# EAGLE design 1-wire_board (EAGLE 6.2)
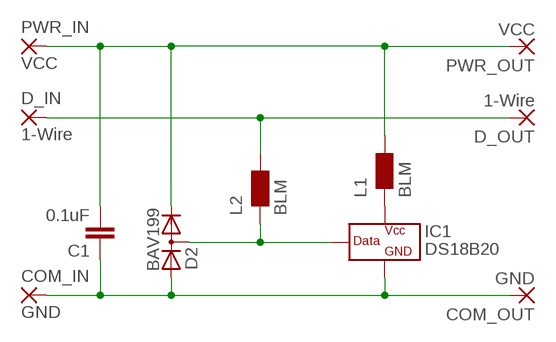
[diagram p0: schematic, sheet 1]

## Parts
C1  0.1uF  CAP0805  [0805]
COM_IN  GND  SMD5  [SMD2,54-5,08]
COM_OUT  GND  SMD5  [SMD2,54-5,08]
D2  BAV199  [SOT23]
D_IN  1-Wire  SMD5  [SMD2,54-5,08]
D_OUT  1-Wire  SMD5  [SMD2,54-5,08]
IC1  DS18B20  [TO92-]
L1  BLM  WE-KIHQWE-KI_0805  [0805]
L2  BLM  WE-KIHQWE-KI_0805  [0805]
PWR_IN  VCC  SMD5  [SMD2,54-5,08]
PWR_OUT  VCC  SMD5  [SMD2,54-5,08]

## Nets
N$1: D2.3(AC) IC1.2(DATA) L2.1
N$2: D_IN.1(P) D_OUT.1(P) L2.2
N$3: C1.1 COM_IN.1(P) COM_OUT.1(P) D2.1(A) IC1.1(GND)
N$4: C1.2 D2.2(C) L1.2 PWR_IN.1(P) PWR_OUT.1(P)
N$5: IC1.3(VCC) L1.1

## Library data of the parts
C1 = GravicapaLib:CAP: Capacitor Standard 0603 ceramic capacitor, and 0.1" leaded capacitor.
COM_IN COM_OUT D_IN D_OUT PWR_IN PWR_OUT = wirepad:SMD5: SMD PAD
D2 = GravicapaLib:BAV199: DIODE low-leakage double diode
IC1 = GravicapaLib:DS18B20: Programmable Resolution Digital Thermometer This chip provides a onewire thermosensor with approx. 0.5°C accuracy. A programmable over/undertemperure alarm is available. The precision can be set from 9..12 bits. Notes: Vdd must be applied for accurate measurements at low temperatures, as the parasite power circuit otherwise heats the sensor. If parasite power is used, Vdd has to be connected to GND. The DS1822 is a low-cost thermometer chip, the DS18S20 is similar to the DS18B20, but with 9 Bit precision only. Author: Jan Kandziora <jjj@gmx.de>
L1 L2 = wuerth-elektronik:WE-KIHQ: SMD Wire Wound Ceramic Inductor WE-KIHQ - High current - Highest Quality factor in size 0805 - up to 98 - High thermal stability - High SRF -- Bluetooth -- Wireless LAN -- RF oscillation circuit -- IF impedance matching -- IG choke

## Board
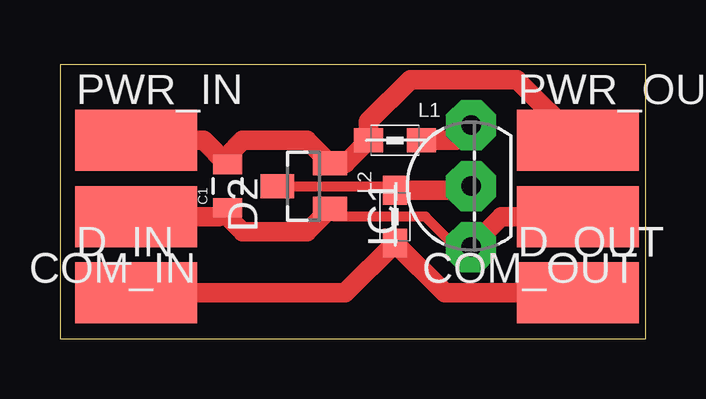
[diagram p1: board, top side]

Size 24.43 x 11.42 mm. Coordinates in mm from the lower left corner, seen from the top.
Outline: 0,0 24.43,0 24.43,11.42 0,11.42 0,0
Copper layers (1*16): Top 0.035mm / dielectric 1.5mm / Bottom 0.035mm
Design rules: minimum track width 10mil, minimum drill 32mil, track to track 12mil, track to pad 12mil, pad to pad 12mil, via to via 12mil, smd to smd 8mil, copper to edge 40mil, drill to drill 40mil, minimum pad ring 25mil, minimum via ring 12mil, stop-mask expansion 4mil, vias tented up to drill 0mil, thermal gap 10mil

### Footprints (pad centres in the part's own frame; a part is rotated, then mirrored left to right if it is on the bottom)
0805 = smd 0.8 x 1.2: 1 -0.9,0; 2 0.9,0
SMD2,54-5,08 = smd 2.54 x 5.08: 1 0,0
SOT23 = smd 1 x 1.4: 1 -0.95,-1.1; 2 0.95,-1.1; 3 0,1.1
TO92- = drill 0.813 octagon: 1 -2.54,0; 2 0,0; 3 2.54,0
0805' = smd 1.2 x 1: 1 -1.1,0; 2 1.1,0

### Placement (x,y rotation side)
C1  6.99,6.35 90 top
COM_IN  3.17,5.08 90 top
COM_OUT  21.59,5.08 90 top
D2  10.16,6.35 90 top
D_IN  3.17,1.9 270 top
D_OUT  21.59,1.9 270 top
IC1  17.14,6.35 90 top
L1  BLM  [0805']  13.97,8.25 180 top
L2  BLM  [0805']  13.97,5.08 270 top
PWR_IN  3.17,8.25 270 top
PWR_OUT  21.59,8.25 270 top

### Tracks (layer width: path | path; a pad name or v marks a point on that pad's centre or on a via)
N$1
  Top 0.406: D2.3 13.8,6.35 L2.1 | 16.97,6.18 IC1.2
  Top 0.813: L2.1 16.97,6.18
N$2
  Top 0.813: D_IN.1 11.89,1.9 L2.2 16.04,1.9 D_OUT.1
N$3
  Top 0.406: C1.1 6.99,5.08 | IC1.1 16.51,3.81 15.24,5.08 11.43,5.08 11.11,5.4 D2.1
  Top 0.813: COM_IN.1 6.61,5.08 C1.1 | 6.99,5.08 7.62,4.45 10.3,4.45 D2.1 | IC1.1 18.41,5.08 COM_OUT.1
N$4
  Top 0.406: C1.2 6.99,7.62
  Top 0.813: PWR_IN.1 5.98,8.25 C1.2 | 6.99,7.62 7.62,8.25 10.3,8.25 D2.2 11.91,7.3 L1.2 12.87,9.06 14.61,10.79 19.05,10.79 PWR_OUT.1
N$5
  Top 0.813: L1.1 16.51,8.25 IC1.3